# Altium schematic sheet Ports.SchDoc
size A3
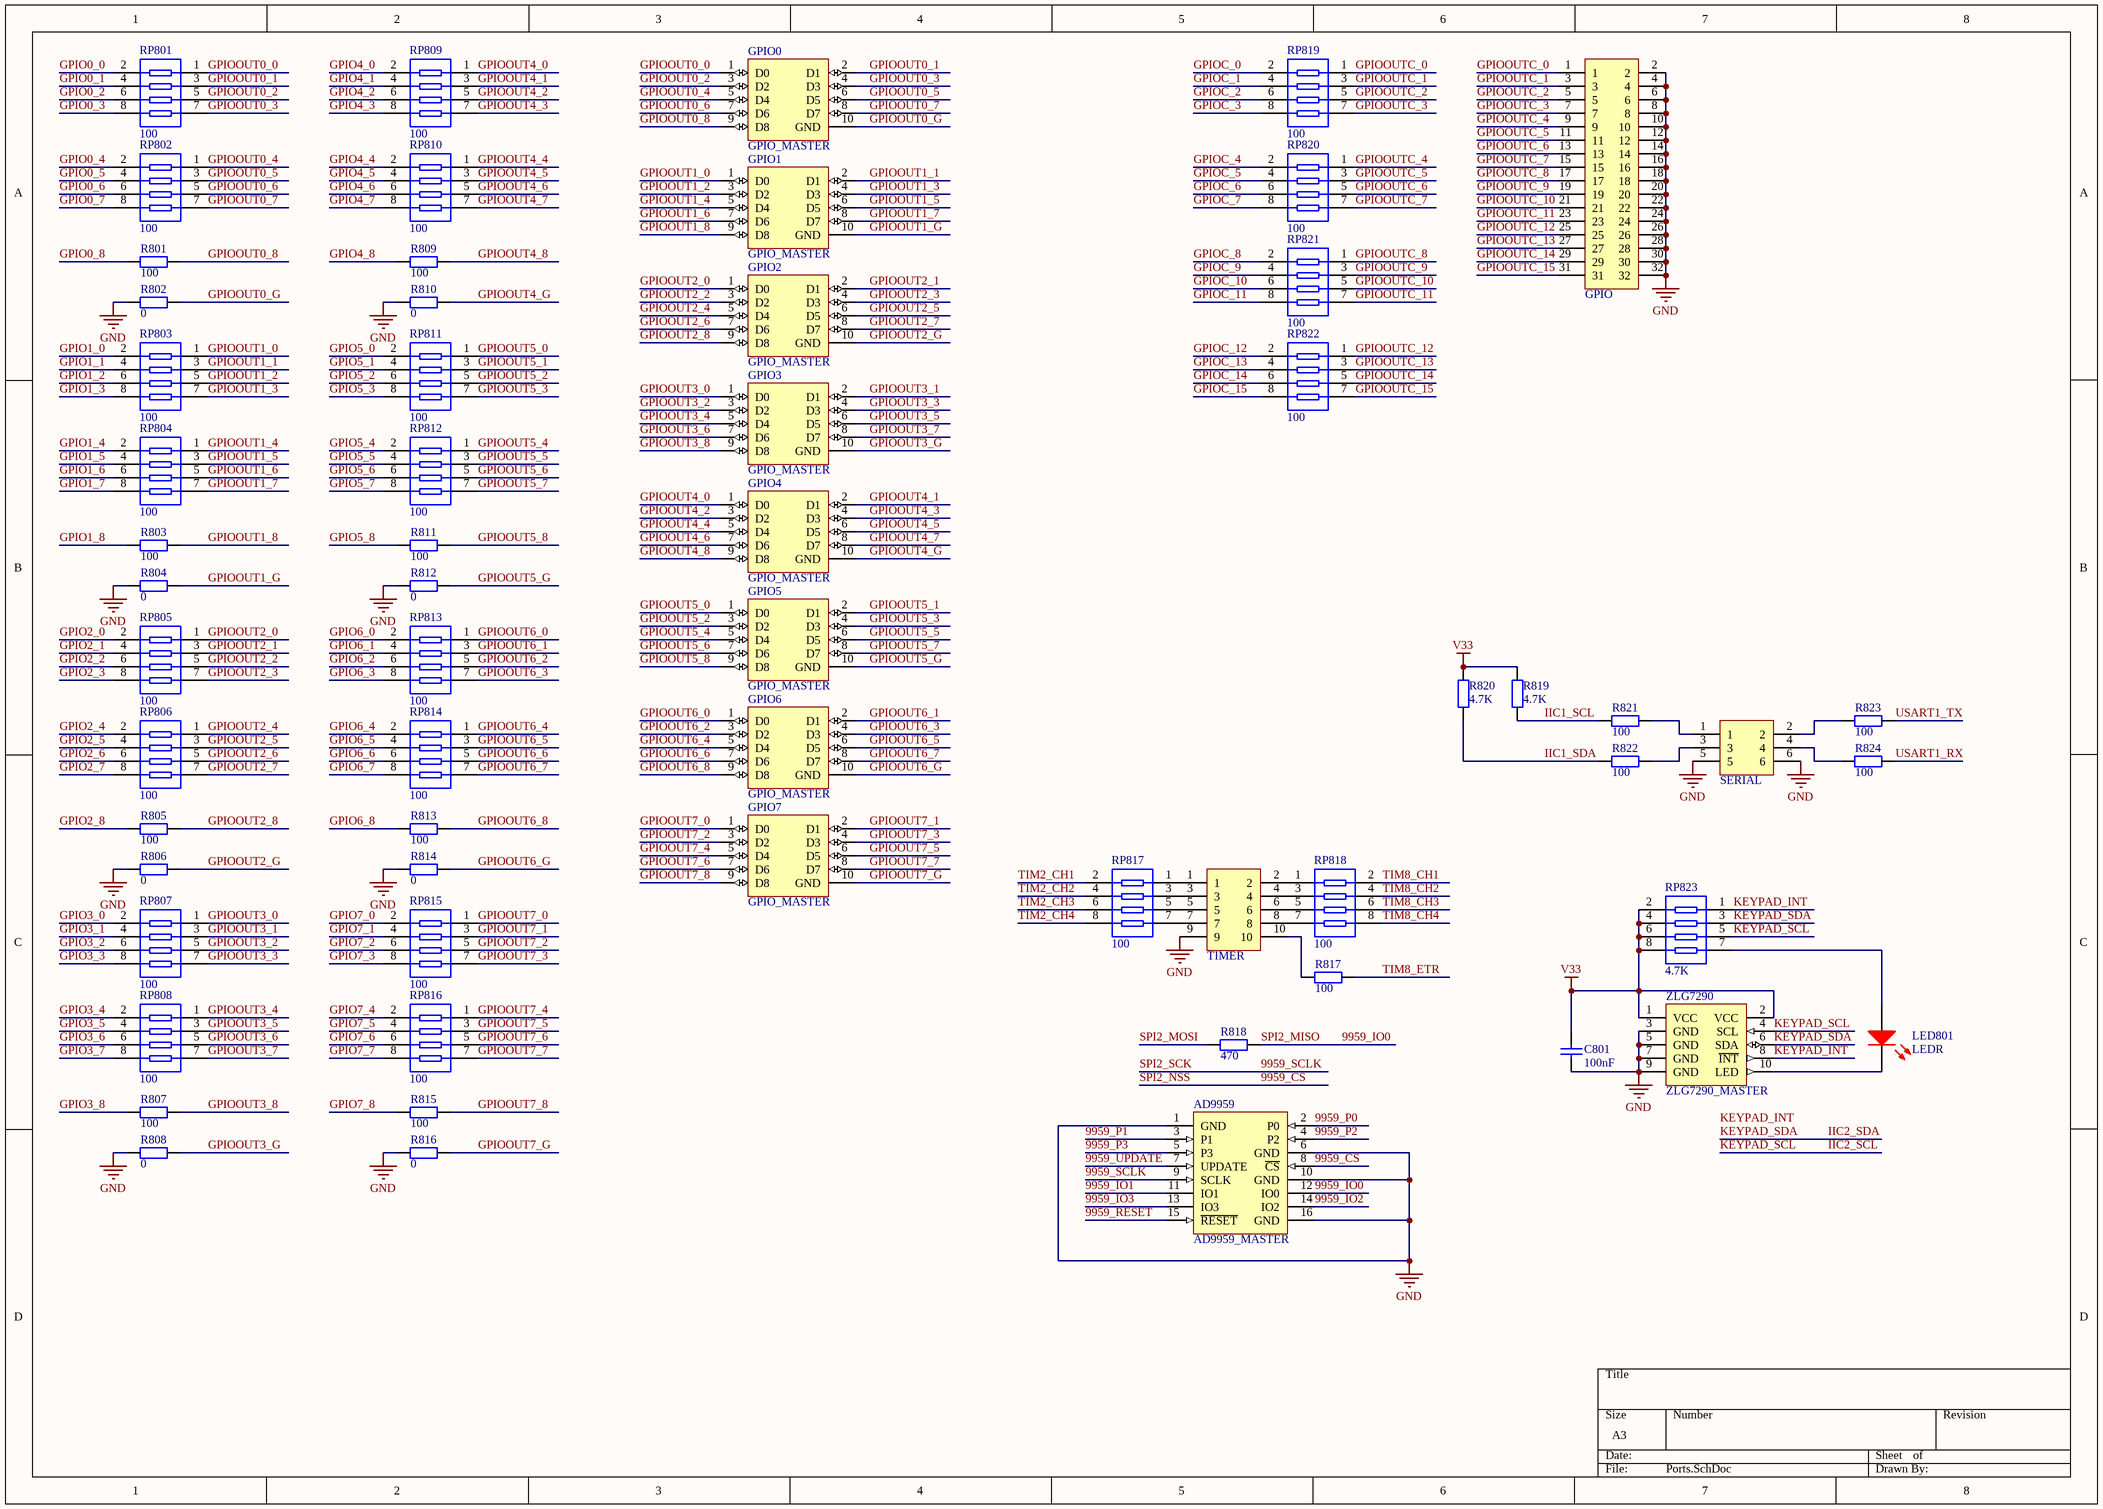
[diagram p0: Ports.SchDoc]

## Parts
AD9959  AD9959_MASTER  [IDC16]
C801  value 100nF  [0805C]  (hidden comment: MLCC)
GPIO  Dual 16 pin port  [201S2X16]  (value not drawn)
GPIO0  GPIO_MASTER  [IDC10]
GPIO1  GPIO_MASTER  [IDC10]
GPIO2  GPIO_MASTER  [IDC10]
GPIO3  GPIO_MASTER  [IDC10]
GPIO4  GPIO_MASTER  [IDC10]
GPIO5  GPIO_MASTER  [IDC10]
GPIO6  GPIO_MASTER  [IDC10]
GPIO7  GPIO_MASTER  [IDC10]
LED801  LEDR  [LED1206R]
R801  value 100  [0603R]  (hidden comment: Resistor)
R802  value 0  [0603R]  (hidden comment: Resistor)
R803  value 100  [0603R]  (hidden comment: Resistor)
R804  value 0  [0603R]  (hidden comment: Resistor)
R805  value 100  [0603R]  (hidden comment: Resistor)
R806  value 0  [0603R]  (hidden comment: Resistor)
R807  value 100  [0603R]  (hidden comment: Resistor)
R808  value 0  [0603R]  (hidden comment: Resistor)
R809  value 100  [0603R]  (hidden comment: Resistor)
R810  value 0  [0603R]  (hidden comment: Resistor)
R811  value 100  [0603R]  (hidden comment: Resistor)
R812  value 0  [0603R]  (hidden comment: Resistor)
R813  value 100  [0603R]  (hidden comment: Resistor)
R814  value 0  [0603R]  (hidden comment: Resistor)
R815  value 100  [0603R]  (hidden comment: Resistor)
R816  value 0  [0603R]  (hidden comment: Resistor)
R817  value 100  [0603R]  (hidden comment: Resistor)
R818  value 470  [0603R]  (hidden comment: Resistor)
R819  value 4.7K  [0603R]  (hidden comment: Resistor)
R820  value 4.7K  [0603R]  (hidden comment: Resistor)
R821  value 100  [0603R]  (hidden comment: Resistor)
R822  value 100  [0603R]  (hidden comment: Resistor)
R823  value 100  [0603R]  (hidden comment: Resistor)
R824  value 100  [0603R]  (hidden comment: Resistor)
RP801  value 100  [8P4R_0603]  (hidden comment: Res Pack)
RP802  value 100  [8P4R_0603]  (hidden comment: Res Pack)
RP803  value 100  [8P4R_0603]  (hidden comment: Res Pack)
RP804  value 100  [8P4R_0603]  (hidden comment: Res Pack)
RP805  value 100  [8P4R_0603]  (hidden comment: Res Pack)
RP806  value 100  [8P4R_0603]  (hidden comment: Res Pack)
RP807  value 100  [8P4R_0603]  (hidden comment: Res Pack)
RP808  value 100  [8P4R_0603]  (hidden comment: Res Pack)
RP809  value 100  [8P4R_0603]  (hidden comment: Res Pack)
RP810  value 100  [8P4R_0603]  (hidden comment: Res Pack)
RP811  value 100  [8P4R_0603]  (hidden comment: Res Pack)
RP812  value 100  [8P4R_0603]  (hidden comment: Res Pack)
RP813  value 100  [8P4R_0603]  (hidden comment: Res Pack)
RP814  value 100  [8P4R_0603]  (hidden comment: Res Pack)
RP815  value 100  [8P4R_0603]  (hidden comment: Res Pack)
RP816  value 100  [8P4R_0603]  (hidden comment: Res Pack)
RP817  value 100  [8P4R_0603]  (hidden comment: Res Pack)
RP818  value 100  [8P4R_0603]  (hidden comment: Res Pack)
RP819  value 100  [8P4R_0603]  (hidden comment: Res Pack)
RP820  value 100  [8P4R_0603]  (hidden comment: Res Pack)
RP821  value 100  [8P4R_0603]  (hidden comment: Res Pack)
RP822  value 100  [8P4R_0603]  (hidden comment: Res Pack)
RP823  value 4.7K  [8P4R_0603]  (hidden comment: Res Pack)
SERIAL  Dual 3 pin port  [201S2X3]  (value not drawn)
TIMER  IDC10  [IDC10]  (value not drawn)
ZLG7290  ZLG7290_MASTER  [IDC10]

## Nets
GND: AD9959.1(GND) AD9959.6(GND) AD9959.10(GND) AD9959.16(GND) C801.1 GPIO.2 GPIO.4 GPIO.6 GPIO.8 GPIO.10 GPIO.12 GPIO.14 GPIO.16 GPIO.18 GPIO.20 GPIO.22 GPIO.24 GPIO.26 GPIO.28 GPIO.30 GPIO.32 R802.1 R804.1 R806.1 R808.1 R810.1 R812.1 R814.1 R816.1 SERIAL.5 SERIAL.6 TIMER.9 ZLG7290.3(GND) ZLG7290.5(GND) ZLG7290.7(GND) ZLG7290.9(GND)
V33: C801.2 R819.2 R820.2 RP823.2 RP823.4 RP823.6 RP823.8 ZLG7290.1(VCC) ZLG7290.2(VCC)
9959_CS: AD9959.8(~{CS})  [also labelled SPI2_NSS]
9959_IO0: AD9959.12(IO0) R818.2  [also labelled SPI2_MISO]
9959_IO1: AD9959.11(IO1)
9959_IO2: AD9959.14(IO2)
9959_IO3: AD9959.13(IO3)
9959_P0: AD9959.2(P0)
9959_P1: AD9959.3(P1)
9959_P2: AD9959.4(P2)
9959_P3: AD9959.5(P3)
9959_RESET: AD9959.15(~{RESET})
9959_SCLK: AD9959.9(SCLK)  [also labelled SPI2_SCK]
9959_UPDATE: AD9959.7(UPDATE)
GPIO0_0: RP801.2
GPIO0_1: RP801.4
GPIO0_2: RP801.6
GPIO0_3: RP801.8
GPIO0_4: RP802.2
GPIO0_5: RP802.4
GPIO0_6: RP802.6
GPIO0_7: RP802.8
GPIO0_8: R801.1
GPIO1_0: RP803.2
GPIO1_1: RP803.4
GPIO1_2: RP803.6
GPIO1_3: RP803.8
GPIO1_4: RP804.2
GPIO1_5: RP804.4
GPIO1_6: RP804.6
GPIO1_7: RP804.8
GPIO1_8: R803.1
GPIO2_0: RP805.2
GPIO2_1: RP805.4
GPIO2_2: RP805.6
GPIO2_3: RP805.8
GPIO2_4: RP806.2
GPIO2_5: RP806.4
GPIO2_6: RP806.6
GPIO2_7: RP806.8
GPIO2_8: R805.1
GPIO3_0: RP807.2
GPIO3_1: RP807.4
GPIO3_2: RP807.6
GPIO3_3: RP807.8
GPIO3_4: RP808.2
GPIO3_5: RP808.4
GPIO3_6: RP808.6
GPIO3_7: RP808.8
GPIO3_8: R807.1
GPIO4_0: RP809.2
GPIO4_1: RP809.4
GPIO4_2: RP809.6
GPIO4_3: RP809.8
GPIO4_4: RP810.2
GPIO4_5: RP810.4
GPIO4_6: RP810.6
GPIO4_7: RP810.8
GPIO4_8: R809.1
GPIO5_0: RP811.2
GPIO5_1: RP811.4
GPIO5_2: RP811.6
GPIO5_3: RP811.8
GPIO5_4: RP812.2
GPIO5_5: RP812.4
GPIO5_6: RP812.6
GPIO5_7: RP812.8
GPIO5_8: R811.1
GPIO6_0: RP813.2
GPIO6_1: RP813.4
GPIO6_2: RP813.6
GPIO6_3: RP813.8
GPIO6_4: RP814.2
GPIO6_5: RP814.4
GPIO6_6: RP814.6
GPIO6_7: RP814.8
GPIO6_8: R813.1
GPIO7_0: RP815.2
GPIO7_1: RP815.4
GPIO7_2: RP815.6
GPIO7_3: RP815.8
GPIO7_4: RP816.2
GPIO7_5: RP816.4
GPIO7_6: RP816.6
GPIO7_7: RP816.8
GPIO7_8: R815.1
GPIOC_0: RP819.2
GPIOC_1: RP819.4
GPIOC_2: RP819.6
GPIOC_3: RP819.8
GPIOC_4: RP820.2
GPIOC_5: RP820.4
GPIOC_6: RP820.6
GPIOC_7: RP820.8
GPIOC_8: RP821.2
GPIOC_9: RP821.4
GPIOC_10: RP821.6
GPIOC_11: RP821.8
GPIOC_12: RP822.2
GPIOC_13: RP822.4
GPIOC_14: RP822.6
GPIOC_15: RP822.8
GPIOOUT0_0: GPIO0.1(D0) RP801.1
GPIOOUT0_1: GPIO0.2(D1) RP801.3
GPIOOUT0_2: GPIO0.3(D2) RP801.5
GPIOOUT0_3: GPIO0.4(D3) RP801.7
GPIOOUT0_4: GPIO0.5(D4) RP802.1
GPIOOUT0_5: GPIO0.6(D5) RP802.3
GPIOOUT0_6: GPIO0.7(D6) RP802.5
GPIOOUT0_7: GPIO0.8(D7) RP802.7
GPIOOUT0_8: GPIO0.9(D8) R801.2
GPIOOUT0_G: GPIO0.10(GND) R802.2
GPIOOUT1_0: GPIO1.1(D0) RP803.1
GPIOOUT1_1: GPIO1.2(D1) RP803.3
GPIOOUT1_2: GPIO1.3(D2) RP803.5
GPIOOUT1_3: GPIO1.4(D3) RP803.7
GPIOOUT1_4: GPIO1.5(D4) RP804.1
GPIOOUT1_5: GPIO1.6(D5) RP804.3
GPIOOUT1_6: GPIO1.7(D6) RP804.5
GPIOOUT1_7: GPIO1.8(D7) RP804.7
GPIOOUT1_8: GPIO1.9(D8) R803.2
GPIOOUT1_G: GPIO1.10(GND) R804.2
GPIOOUT2_0: GPIO2.1(D0) RP805.1
GPIOOUT2_1: GPIO2.2(D1) RP805.3
GPIOOUT2_2: GPIO2.3(D2) RP805.5
GPIOOUT2_3: GPIO2.4(D3) RP805.7
GPIOOUT2_4: GPIO2.5(D4) RP806.1
GPIOOUT2_5: GPIO2.6(D5) RP806.3
GPIOOUT2_6: GPIO2.7(D6) RP806.5
GPIOOUT2_7: GPIO2.8(D7) RP806.7
GPIOOUT2_8: GPIO2.9(D8) R805.2
GPIOOUT2_G: GPIO2.10(GND) R806.2
GPIOOUT3_0: GPIO3.1(D0) RP807.1
GPIOOUT3_1: GPIO3.2(D1) RP807.3
GPIOOUT3_2: GPIO3.3(D2) RP807.5
GPIOOUT3_3: GPIO3.4(D3) RP807.7
GPIOOUT3_4: GPIO3.5(D4) RP808.1
GPIOOUT3_5: GPIO3.6(D5) RP808.3
GPIOOUT3_6: GPIO3.7(D6) RP808.5
GPIOOUT3_7: GPIO3.8(D7) RP808.7
GPIOOUT3_8: GPIO3.9(D8) R807.2
GPIOOUT3_G: GPIO3.10(GND) R808.2
GPIOOUT4_0: GPIO4.1(D0) RP809.1
GPIOOUT4_1: GPIO4.2(D1) RP809.3
GPIOOUT4_2: GPIO4.3(D2) RP809.5
GPIOOUT4_3: GPIO4.4(D3) RP809.7
GPIOOUT4_4: GPIO4.5(D4) RP810.1
GPIOOUT4_5: GPIO4.6(D5) RP810.3
GPIOOUT4_6: GPIO4.7(D6) RP810.5
GPIOOUT4_7: GPIO4.8(D7) RP810.7
GPIOOUT4_8: GPIO4.9(D8) R809.2
GPIOOUT4_G: GPIO4.10(GND) R810.2
GPIOOUT5_0: GPIO5.1(D0) RP811.1
GPIOOUT5_1: GPIO5.2(D1) RP811.3
GPIOOUT5_2: GPIO5.3(D2) RP811.5
GPIOOUT5_3: GPIO5.4(D3) RP811.7
GPIOOUT5_4: GPIO5.5(D4) RP812.1
GPIOOUT5_5: GPIO5.6(D5) RP812.3
GPIOOUT5_6: GPIO5.7(D6) RP812.5
GPIOOUT5_7: GPIO5.8(D7) RP812.7
GPIOOUT5_8: GPIO5.9(D8) R811.2
GPIOOUT5_G: GPIO5.10(GND) R812.2
GPIOOUT6_0: GPIO6.1(D0) RP813.1
GPIOOUT6_1: GPIO6.2(D1) RP813.3
GPIOOUT6_2: GPIO6.3(D2) RP813.5
GPIOOUT6_3: GPIO6.4(D3) RP813.7
GPIOOUT6_4: GPIO6.5(D4) RP814.1
GPIOOUT6_5: GPIO6.6(D5) RP814.3
GPIOOUT6_6: GPIO6.7(D6) RP814.5
GPIOOUT6_7: GPIO6.8(D7) RP814.7
GPIOOUT6_8: GPIO6.9(D8) R813.2
GPIOOUT6_G: GPIO6.10(GND) R814.2
GPIOOUT7_0: GPIO7.1(D0) RP815.1
GPIOOUT7_1: GPIO7.2(D1) RP815.3
GPIOOUT7_2: GPIO7.3(D2) RP815.5
GPIOOUT7_3: GPIO7.4(D3) RP815.7
GPIOOUT7_4: GPIO7.5(D4) RP816.1
GPIOOUT7_5: GPIO7.6(D5) RP816.3
GPIOOUT7_6: GPIO7.7(D6) RP816.5
GPIOOUT7_7: GPIO7.8(D7) RP816.7
GPIOOUT7_8: GPIO7.9(D8) R815.2
GPIOOUT7_G: GPIO7.10(GND) R816.2
GPIOOUTC_0: GPIO.1 RP819.1
GPIOOUTC_1: GPIO.3 RP819.3
GPIOOUTC_2: GPIO.5 RP819.5
GPIOOUTC_3: GPIO.7 RP819.7
GPIOOUTC_4: GPIO.9 RP820.1
GPIOOUTC_5: GPIO.11 RP820.3
GPIOOUTC_6: GPIO.13 RP820.5
GPIOOUTC_7: GPIO.15 RP820.7
GPIOOUTC_8: GPIO.17 RP821.1
GPIOOUTC_9: GPIO.19 RP821.3
GPIOOUTC_10: GPIO.21 RP821.5
GPIOOUTC_11: GPIO.23 RP821.7
GPIOOUTC_12: GPIO.25 RP822.1
GPIOOUTC_13: GPIO.27 RP822.3
GPIOOUTC_14: GPIO.29 RP822.5
GPIOOUTC_15: GPIO.31 RP822.7
IIC1_SCL: R819.1 R821.1
IIC1_SDA: R820.1 R822.1
IIC2_SCL: RP823.5 ZLG7290.4(SCL)  [also labelled KEYPAD_SCL]
IIC2_SDA: RP823.3 ZLG7290.6(SDA)  [also labelled KEYPAD_SDA]
KEYPAD_INT: RP823.1 ZLG7290.8(~{INT})
SPI2_MOSI: R818.1
TIM2_CH1: RP817.2
TIM2_CH2: RP817.4
TIM2_CH3: RP817.6
TIM2_CH4: RP817.8
TIM8_CH1: RP818.2
TIM8_CH2: RP818.4
TIM8_CH3: RP818.6
TIM8_CH4: RP818.8
TIM8_ETR: R817.2
USART1_RX: R824.2
USART1_TX: R823.2
NetLED801_1: LED801.1(A) RP823.7
NetLED801_2: LED801.2(K) ZLG7290.10(LED)
NetR817_1: R817.1 TIMER.10
NetR821_2: R821.2 SERIAL.1
NetR822_2: R822.2 SERIAL.3
NetR823_1: R823.1 SERIAL.2
NetR824_1: R824.1 SERIAL.4
NetRP817_1: RP817.1 TIMER.1
NetRP817_3: RP817.3 TIMER.3
NetRP817_5: RP817.5 TIMER.5
NetRP817_7: RP817.7 TIMER.7
NetRP818_1: RP818.1 TIMER.2
NetRP818_3: RP818.3 TIMER.4
NetRP818_5: RP818.5 TIMER.6
NetRP818_7: RP818.7 TIMER.8

## Notes on the sheet
- Labels drawn without touching a wire or pin: KEYPAD_INT

## Library data of the parts
AD9959 = AD9959_MASTER: DDS module
GPIO = DPORT16
LED801 = LEDR: RED LED
RP801-RP823 = Res Pack: Isolated Resistor Network
SERIAL = DPORT3
ZLG7290 = ZLG7290_MASTER: KEY module